# Altium project PIAR_MainBoard.PrjPcb (part 1 of 2)
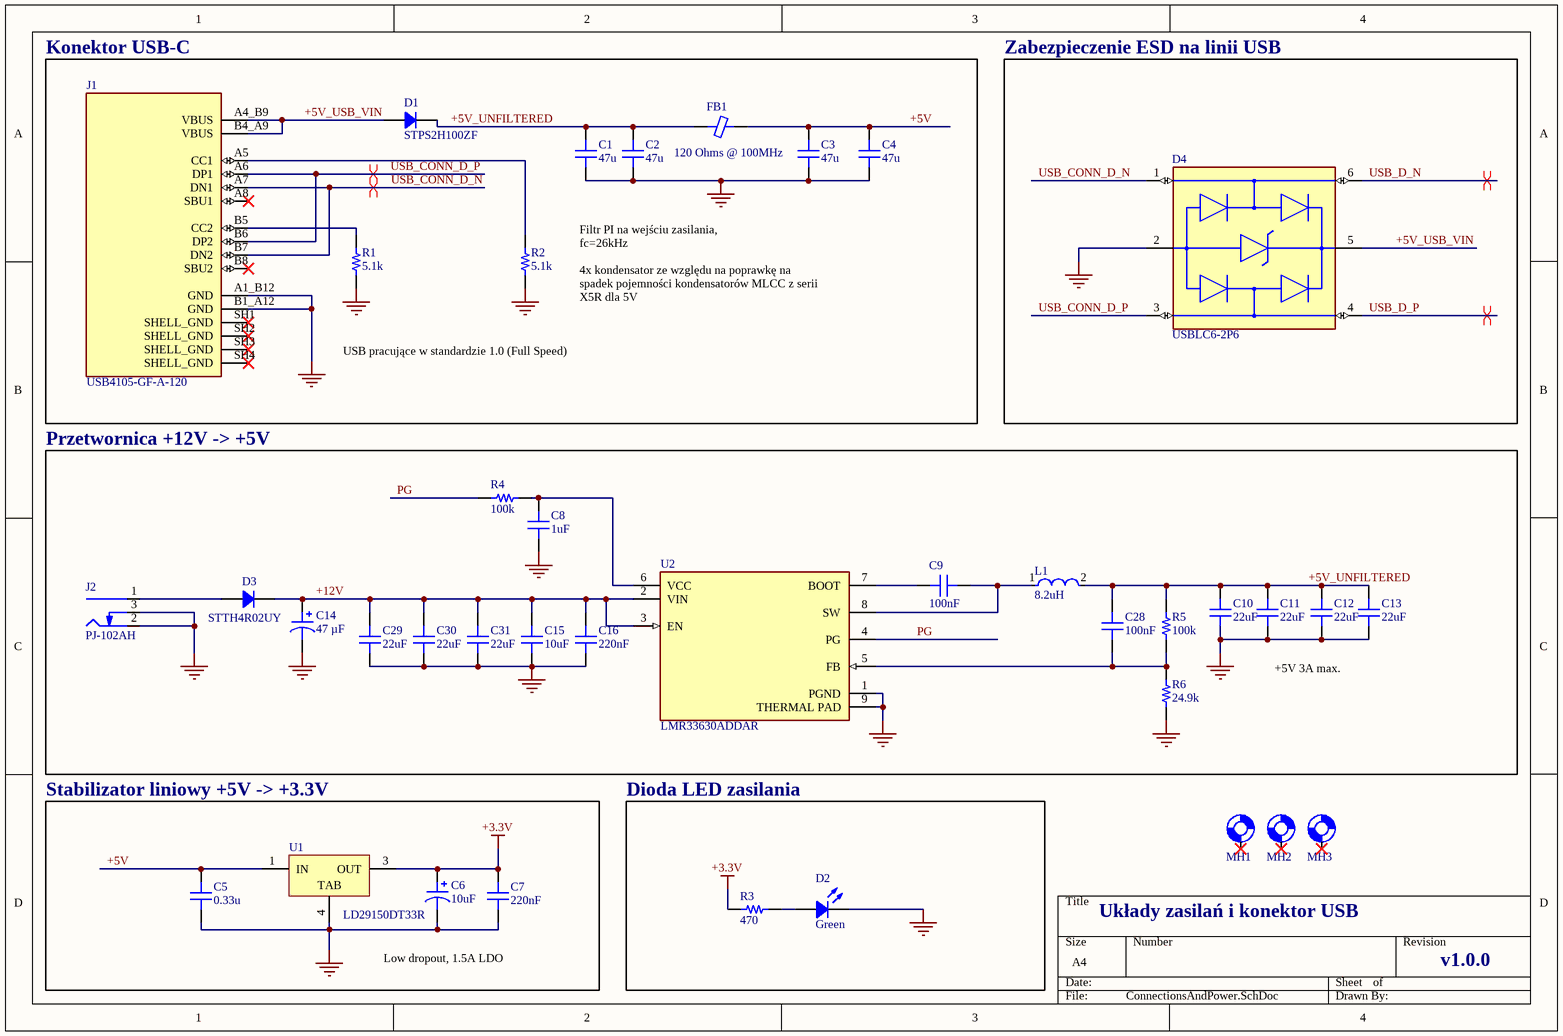
[diagram p0: ConnectionsAndPower.SchDoc]
2 sheets, 79 parts. Net scope: global (net labels, ports and power ports of the same name join across sheets).
Board file: PIAR_MainBoard.PcbDoc
Sheets:
  ConnectionsAndPower.SchDoc
  Motherboard.SchDoc

## Sheet ConnectionsAndPower.SchDoc
size A4; SheetNumber: 1; SheetTotal: 2

### Parts
C1  Capacitance: 47u  [CAP 0805_2012]  (hidden comment: 47 µF)
C2  Capacitance: 47u  [CAP 0805_2012]  (hidden comment: 47 µF)
C3  Capacitance: 47u  [CAP 0805_2012]  (hidden comment: 47 µF)
C4  Capacitance: 47u  [CAP 0805_2012]  (hidden comment: 47 µF)
C5  Capacitance: 0.33u  [CAP 0805_2012]  (hidden comment: 0.33µF)
C6  10uF  [CAP ALSMD POLY 4.3MM H5.5MM]
C7  Capacitance: 220nF  [CAP 0805_2012]  (hidden comment: 0.22 µF)
C8  Capacitance: 1uF  [CAP 0805_2012]  (hidden comment: 1µF)
C9  Capacitance: 100nF  [CAP 0805_2012]  (hidden comment: 0.1 µF)
C10  Capacitance: 22uF  [CAP 0805_2012]  (hidden comment: 22 µF)
C11  Capacitance: 22uF  [CAP 0805_2012]  (hidden comment: 22 µF)
C12  Capacitance: 22uF  [CAP 0805_2012]  (hidden comment: 22 µF)
C13  Capacitance: 22uF  [CAP 0805_2012]  (hidden comment: 22 µF)
C14  47 µF  [CAP ALSMD 4.3MM H5.4MM]
C15  Capacitance: 10uF  [CAP 0805_2012]  (hidden comment: 10 µF)
C16  Capacitance: 220nF  [CAP 0805_2012]  (hidden comment: 0.22 µF)
C28  Capacitance: 100nF  [CAP 0603_1608]  (hidden comment: 0.1 µF)
C29  Capacitance: 22uF  [CAP 0805_2012]  (hidden comment: 22 µF)
C30  Capacitance: 22uF  [CAP 0805_2012]  (hidden comment: 22 µF)
C31  Capacitance: 22uF  [CAP 0805_2012]  (hidden comment: 22 µF)
D1  STPS2H100ZF  [SOD123F]
D2  Green  [LED 0805_2012 GREEN]
D3  STTH4R02UY  [DO214AA SMB]
D4  USBLC6-2P6  [FP-SOT-666-MFG]
FB1  120 Ohms @ 100MHz  [FER 0805_2012]
J1  USB4105-GF-A-120  [USB4105-GF-A-120]
J2  PJ-102AH  [CUI PJ-102AH]
L1  8.2uH  [FP-IHLP-2525CZ-FP_2_413x3-MFG]
MH1  M3 Mounting Hole  [M3_MOUNTING_HOLE]  (value not drawn)
MH2  M3 Mounting Hole  [M3_MOUNTING_HOLE]  (value not drawn)
MH3  M3 Mounting Hole  [M3_MOUNTING_HOLE]  (value not drawn)
R1  5.1k  [RES 0805_2012]
R2  5.1k  [RES 0805_2012]
R3  470  [RES 0805_2012]
R4  100k  [RES 0805_2012]
R5  100k  [RES 0805_2012]
R6  24.9k  [RES 0805_2012]
U1  LD29150DT33R  [TO-252_L]
U2  LMR33630ADDAR  [FP-DDA0008J-IPC_B]

### Blocks framed on the sheet
Konektor USB-C: C1-C4 D1 FB1 J1 R1 R2
Zabezpieczenie ESD na linii USB: D4
Przetwornica +12V -> +5V: C8-C16 C28-C31 D3 J2 L1 R4-R6 U2
Stabilizator liniowy +5V -> +3.3V: C5-C7 U1
Dioda LED zasilania: D2 R3

### Nets
+3.3V: C6.1 C7.2 R3.1 U1.3(OUT)
+5V: C3.2 C4.2 C5.2 FB1.2 U1.1(IN)
+12V: C14.1 C15.2 C16.2 C29.2 C30.2 C31.2 D3.2 U2.2(VIN) U2.3(EN)
GND: C1.1 C2.1 C3.1 C4.1 C5.1 C6.2 C7.1 C8.1 C10.1 C11.1 C12.1 C13.1 C14.2 C15.1 C16.1 C29.1 C30.1 C31.1 D2.2 D4.2(GND) J1.A1_B12(GND) J1.B1_A12(GND) J2.2(Outer) J2.3(SW) R1.1 R2.1 R6.1 U1.4(TAB) U2.1(PGND) U2.9(THERMAL_PAD)
+5V_UNFILTERED: C1.2 C2.2 C10.2 C11.2 C12.2 C13.2 C28.2 D1.2 FB1.1 L1.2 R5.1
+5V_USB_VIN: D1.1 D4.5(VBUS) J1.A4_B9(VBUS) J1.B4_A9(VBUS)
PG: R4.2 U2.4(PG)
USB_CONN_D_N: D4.1(I/O1) J1.A7(DN1) J1.B7(DN2)
USB_CONN_D_P: D4.3(I/O2) J1.A6(DP1) J1.B6(DP2)
USB_D_N: D4.6(I/O1)
USB_D_P: D4.4(I/O2)
NetC8_2: C8.2 R4.1 U2.6(VCC)
NetC9_1: C9.1 L1.1 U2.8(SW)
NetC9_2: C9.2 U2.7(BOOT)
NetC28_1: C28.1 R5.2 R6.2 U2.5(FB)
NetD2_1: D2.1 R3.2
NetD3_1: D3.1 J2.1(Centre)
NetJ1_A5: J1.A5(CC1) R2.2
NetJ1_B5: J1.B5(CC2) R1.2

Not connected (* = marked no-connect by the designer): J1 A8(SBU1)* B8(SBU2)* SH1(SHELL_GND)* SH2(SHELL_GND)* SH3(SHELL_GND)* SH4(SHELL_GND)*; MH1 1*; MH2 1*; MH3 1*

### Layout directives
differential pair: USB_CONN_D_N, USB_CONN_D_P, USB_D_N, USB_D_P

### Notes on the sheet
- Filtr PI na wejściu zasilania,
  fc=26kHz
  4x kondensator ze względu na poprawkę na spadek pojemności kondensatorów MLCC z serii X5R dla 5V
- USB pracujące w standardzie 1.0 (Full Speed)
- +5V 3A max.
- Układy zasilań i konektor USB
- Low dropout, 1.5A LDO
- v1.0.0

### Library data of the parts
C1-C4 = CL21A476MQYNNNE: CAP CER 47UF 6.3V X5R 0805; manufacturer: Samsung Electro-Mechanics; Tolerance: ±20%; Part Number: CL21A476MQYNNNE; Applications: General Purpose; componentlink1description: Datasheet; componentlink1url: http://www.samsungsem.com/kr/support/product-search/mlcc/CL21A476MQYNNNE.jsp; componentlink2description: DigiKey Link; componentlink2url: https://www.digikey.com/en/products/detail/samsung-electro-mechanics/CL21A476MQYNNNE/3887510; Device Package: 0805 (2012 Metric); lastupdated: 09/02/2024 20:16:07; Lifecycle Status: Active; Minimum Order: 1; Mounting Type: Surface Mount, MLCC; Operating Temperature: -55°C ~ 85°C; Package / Case: 0805 (2012 Metric); packaging: TapeAndReel; partid: 3143; Part Status: Active; price: 0.04; series: CL; Size / Dimension: 0.079" L x 0.049" W (2.00mm x 1.25mm); Supplier 1: DigiKey; Supplier Part Number 1: 1276-1852-1-ND; Temperature Coefficient: X5R; Thickness (Max): 0.057" (1.45mm); value: 47 µF; Voltage - Rated: 6.3V
C5 = 08055C334JAT2A: CAP CER 0.33UF 50V X7R 0805; manufacturer: AVX Corporation; Tolerance: ±5%; Part Number: 08055C334JAT2A; Applications: General Purpose; componentlink1description: Datasheet; componentlink1url: http://datasheets.avx.com/X7RDielectric.pdf; componentlink2description: DigiKey Link; componentlink2url: http://digikey.com/product-detail/en/avx-corporation/08055C334JAT2A/478-10554-1-ND/6797428; Device Package: 0805 (2012 Metric); lastupdated: 02/09/2020 01:04:40; Lifecycle Status: Active; Minimum Order: 1; Mounting Type: Surface Mount, MLCC; Operating Temperature: -55°C ~ 125°C; Package / Case: 0805 (2012 Metric); packaging: TapeAndReel; partid: 3295; Part Status: Active; price: 0.14; series: -; Size / Dimension: 0.079" L x 0.049" W (2.00mm x 1.25mm); Supplier 1: DigiKey; Supplier Part Number 1: 478-10554-1-ND; Temperature Coefficient: X7R; Thickness (Max): 0.037" (0.94mm); value: 0.33µF; Voltage - Rated: 50V
C6 = 10SVP10M: CAP ALUM POLY 10UF 20% 10V SMD; manufacturer: Panasonic Electronic Components; Capacitance: 10µF; ESR (Equivalent Series Resistance): 22mOhm; Lifetime @ Temp.: 2000 Hrs @ 105°C; Ripple Current @ High Frequency: 700mA @ 100kHz; Ripple Current @ Low Frequency: 35mA @ 120Hz; Surface Mount Land Size: 0.169" L x 0.169" W (4.30mm x 4.30mm); Type: Polymer; value: 10µF; Part Number: 10SVP10M; Applications: General Purpose; componentlink1description: Datasheet; componentlink1url: http://industrial.panasonic.com/www-cgi/jvcr13pz.cgi?E+CI+4+AAB8008+10SVP10M+8+WW; componentlink2description: DigiKey Link; componentlink2url: http://digikey.com/product-detail/en/panasonic-electronic-components/10SVP10M/P16427CT-ND/4204209; Device Package: Radial, Can - SMD; Height - Seated (Max): 0.217" (5.50mm); lastupdated: 02/09/2020 01:22:02; Lifecycle Status: Active; Minimum Order: 1; Mounting Type: Surface Mount; Operating Temperature: -55°C ~ 105°C; Package / Case: Radial, Can - SMD; packaging: TapeAndReel; partid: 1855; Part Status: Active; price: 0.35; series: OS-CON™, SVP; Size / Dimension: 0.157" Dia (4.00mm); Supplier 1: DigiKey; Supplier Part Number 1: P16427CT-ND; Tolerance: ±20%; Voltage - Rated: 10V
C7 C16 = C0805C224J1REC7800: CAP CER 0805 220NF 100V X7R 5%; manufacturer: KEMET; Part Number: C0805C224J1REC7800; Applications: ESD Protection; componentlink1description: Datasheet; componentlink1url: https://api.kemet.com/component-edge/download/datasheet/C0805C224J1REC7800.pdf; componentlink2description: DigiKey Link; componentlink2url: https://www.digikey.com/en/products/detail/kemet/C0805C224J1REC7800/8643769; Device Package: 0805 (2012 Metric); lastupdated: 09/02/2024 20:15:02; Lifecycle Status: Active; Minimum Order: 1; Mounting Type: Surface Mount, MLCC; Operating Temperature: -55°C ~ 125°C; Package / Case: 0805 (2012 Metric); packaging: TapeAndReel; partid: 31561; Part Status: Active; price: 0.04; series: ESD SMD Comm X7R; Size / Dimension: 0.079" L x 0.049" W (2.00mm x 1.25mm); Supplier 1: DigiKey; Supplier Part Number 1: 399-C0805C224J1REC7800CT-ND; Temperature Coefficient: X7R; Thickness (Max): 0.055" (1.40mm); Tolerance: ±5%; value: 0.22 µF; Voltage - Rated: 100V
C8 = 08055C105K4Z2A: CAP CER 1UF 50V X7R 0805; manufacturer: AVX Corporation; Tolerance: ±10%; Part Number: 08055C105K4Z2A; Applications: Automotive, Boardflex Sensitive; componentlink1description: Datasheet; componentlink1url: http://datasheets.avx.com/FlexitermMLCC.pdf; componentlink2description: DigiKey Link; componentlink2url: http://digikey.com/product-detail/en/avx-corporation/08055C105K4Z2A/478-9557-1-ND/5322895; Device Package: 0805 (2012 Metric); Features: Soft Termination; lastupdated: 02/09/2020 01:04:41; Lifecycle Status: Active; Minimum Order: 1; Mounting Type: Surface Mount, MLCC; Operating Temperature: -55°C ~ 125°C; Package / Case: 0805 (2012 Metric); packaging: TapeAndReel; partid: 2983; Part Status: Active; price: 0.09; Ratings: AEC-Q200; series: FLEXITERM®; Size / Dimension: 0.079" L x 0.049" W (2.00mm x 1.25mm); Supplier 1: DigiKey; Supplier Part Number 1: 478-9557-1-ND; Temperature Coefficient: X7R; Thickness (Max): 0.055" (1.40mm); value: 1µF; Voltage - Rated: 50V
C9 = CC0805MRX7R9BB104: CAP CER 0.1UF 50V X7R 0805; manufacturer: Yageo; Tolerance: ±20%; Part Number: CC0805MRX7R9BB104; Applications: General Purpose; componentlink1description: Datasheet; componentlink1url: https://www.yageo.com/upload/media/product/productsearch/datasheet/mlcc/UPY-GPHC_X7R_6.3V-to-50V_18.pdf; componentlink2description: DigiKey Link; componentlink2url: https://www.digikey.com/en/products/detail/yageo/CC0805MRX7R9BB104/5884281; Device Package: 0805 (2012 Metric); lastupdated: 09/02/2024 20:16:09; Lifecycle Status: Active; Minimum Order: 1; Mounting Type: Surface Mount, MLCC; Operating Temperature: -55°C ~ 125°C; Package / Case: 0805 (2012 Metric); packaging: TapeAndReel; partid: 2475; Part Status: Active; price: 0.01; series: CC; Size / Dimension: 0.079" L x 0.049" W (2.00mm x 1.25mm); Supplier 1: DigiKey; Supplier Part Number 1: 311-4351-1-ND; Temperature Coefficient: X7R; Thickness (Max): 0.037" (0.95mm); value: 0.1 µF; Voltage - Rated: 50V
C10-C13 C29-C31 = CL21A226KOQNNNE: CAP CER 22UF 16V X5R 0805; manufacturer: Samsung Electro-Mechanics; Tolerance: ±10%; Part Number: CL21A226KOQNNNE; Applications: General Purpose; componentlink1description: Datasheet; componentlink1url: http://www.samsungsem.com/kr/support/library/product-catalog/mlcc.jsp; componentlink2description: DigiKey Link; componentlink2url: https://www.digikey.com/en/products/detail/samsung-electro-mechanics/CL21A226KOQNNNE/5961010; Device Package: 0805 (2012 Metric); lastupdated: 09/02/2024 20:16:07; Lifecycle Status: Active; Minimum Order: 1; Mounting Type: Surface Mount, MLCC; Operating Temperature: -55°C ~ 85°C; Package / Case: 0805 (2012 Metric); packaging: TapeAndReel; partid: 3004; Part Status: Active; price: 0.06; series: CL; Size / Dimension: 0.079" L x 0.049" W (2.00mm x 1.25mm); Supplier 1: DigiKey; Supplier Part Number 1: 1276-6526-1-ND; Temperature Coefficient: X5R; Thickness (Max): 0.055" (1.40mm); value: 22 µF; Voltage - Rated: 16V
C14 = EMVA6R3ADA470MD55G: CAP ALUM 47UF 20% 6.3V SMD; manufacturer: United Chemi-Con; Lifetime @ Temp.: 2000 Hrs @ 85°C; Polarization: Polar; Ripple Current @ High Frequency: 35.64 mA @ 100 kHz; Ripple Current @ Low Frequency: 33 mA @ 120 Hz; Surface Mount Land Size: 0.169" L x 0.169" W (4.30mm x 4.30mm); Part Number: EMVA6R3ADA470MD55G; Applications: General Purpose; Capacitance: 47 µF; componentlink1description: Datasheet; componentlink1url: http://www.chemi-con.co.jp/cgi-bin/CAT_DB/SEARCH/cat_db_al.cgi?e=e&j=p&pdfname=mva; componentlink2description: DigiKey Link; componentlink2url: https://www.digikey.com/en/products/detail/united-chemi-con/EMVA6R3ADA470MD55G/756703; Device Package: Radial, Can - SMD; Height - Seated (Max): 0.205" (5.20mm); lastupdated: 03/06/2024 19:53:00; Lifecycle Status: Active; Minimum Order: 1; Mounting Type: Surface Mount; Operating Temperature: -40°C ~ 85°C; Package / Case: Radial, Can - SMD; packaging: TapeAndReel; partid: 7038; Part Status: Active; price: 0.11; series: Alchip™- MVA; Size / Dimension: 0.157" Dia (4.00mm); Supplier 1: DigiKey; Supplier Part Number 1: 565-2056-1-ND; Tolerance: ±20%; value: 47 µF; Voltage - Rated: 6.3 V
C15 = C2012X6S1C106K125AC: CAP CER 10UF 16V X6S 0805; manufacturer: TDK Corporation; Tolerance: ±10%; Part Number: C2012X6S1C106K125AC; Applications: General Purpose; componentlink1description: Datasheet; componentlink1url: https://product.tdk.com/info/en/catalog/datasheets/mlcc_commercial_general_en.pdf?ref_disty=digikey; componentlink2description: DigiKey Link; componentlink2url: https://www.digikey.com/en/products/detail/tdk-corporation/C2012X6S1C106K125AC/2733046; Device Package: 0805 (2012 Metric); Features: Low ESL; lastupdated: 09/02/2024 20:16:08; Lifecycle Status: Active; Minimum Order: 1; Mounting Type: Surface Mount, MLCC; Operating Temperature: -55°C ~ 105°C; Package / Case: 0805 (2012 Metric); packaging: TapeAndReel; partid: 2995; Part Status: Active; price: 0.06; series: C; Size / Dimension: 0.079" L x 0.049" W (2.00mm x 1.25mm); Supplier 1: DigiKey; Supplier Part Number 1: 445-7611-1-ND; Temperature Coefficient: X6S; Thickness (Max): 0.057" (1.45mm); value: 10 µF; Voltage - Rated: 16V
C28 = CL10B104KA8NNNC: CAP CER 0.1UF 25V X7R 0603; manufacturer: Samsung Electro-Mechanics; Tolerance: ±10%; Part Number: CL10B104KA8NNNC; Applications: General Purpose; componentlink1description: Datasheet; componentlink1url: http://www.samsungsem.com/kr/support/product-search/mlcc/CL10B104KA8NNNC.jsp; componentlink2description: DigiKey Link; componentlink2url: https://www.digikey.com/en/products/detail/samsung-electro-mechanics/CL10B104KA8NNNC/3886664; Device Package: 0603 (1608 Metric); lastupdated: 09/02/2024 20:10:20; Lifecycle Status: Active; Minimum Order: 1; Mounting Type: Surface Mount, MLCC; Operating Temperature: -55°C ~ 125°C; Package / Case: 0603 (1608 Metric); packaging: TapeAndReel; partid: 9793; Part Status: Active; price: 0.01; series: CL; Size / Dimension: 0.063" L x 0.031" W (1.60mm x 0.80mm); Supplier 1: DigiKey; Supplier Part Number 1: 1276-1006-1-ND; Temperature Coefficient: X7R; Thickness (Max): 0.035" (0.90mm); value: 0.1 µF; Voltage - Rated: 25V
D1 = STPS2H100ZF: DIODE SCHOTTKY 100V 2A SOD123F; Manufacturer: STMicroelectronics; Current - Reverse Leakage @ Vr: 1 µA @ 100 V; Speed: Fast Recovery =< 500ns, > 200mA (Io); Voltage - Forward (Vf) (Max) @ If: 960 mV @ 4 A; Part Number: STPS2H100ZF; ComponentLink1Description: Datasheet; ComponentLink1URL: http://www.st.com/content/ccc/resource/technical/document/datasheet/group3/e0/1c/dc/bb/11/47/42/2a/DM00321023/files/DM00321023.pdf/jcr:content/translations/en.DM00321023.pdf; ComponentLink2Description: DigiKey Link; ComponentLink2URL: https://www.digikey.com/en/products/detail/stmicroelectronics/STPS2H100ZF/6709839; Current - Average Rectified (Io): 2A; Diode Type: Schottky; LastUpdated: 03/06/2024 19:54:58; Lifecycle Status: Active; Minimum Order: 1; Mounting Type: Surface Mount; Operating Temperature - Junction: -40°C ~ 175°C; Package / Case: SOD-123F; Packaging: TapeAndReel; PartId: 2348; Part Status: Active; Price: 0.06; Series: ECOPACK®2; Supplier 1: DigiKey; Supplier Part Number 1: 497-17152-1-ND; Supplier Device Package: SOD-123F; Voltage - DC Reverse (Vr) (Max): 100 V
D2 = APHCM2012CGCK-F01: LED GREEN CLEAR CHIP SMD; Manufacturer: Kingbright; Configuration: Standard; Current - Test: 20mA; Lens Color: Colorless; Lens Size: 1.30mm x 1.25mm; Lens Style: Rectangle with Flat Top; Millicandela Rating: 50mcd; Viewing Angle: 110°; Voltage - Forward (Vf) (Typ): 2.1V; Wavelength - Dominant: 570nm; Wavelength - Peak: 574nm; Part Number: APHCM2012CGCK-F01; Color: Green; ComponentLink1Description: Datasheet; ComponentLink1URL: http://www.kingbrightusa.com/images/catalog/SPEC/APHCM2012CGCK-F01.pdf; ComponentLink2Description: DigiKey Link; ComponentLink2URL: https://www.digikey.com/en/products/detail/kingbright/APHCM2012CGCK-F01/1747492; Device Package: 0805 (2012 Metric); Height (Max): 0.40mm; LastUpdated: 03/06/2024 20:00:30; Lens Transparency: Clear; Lifecycle Status: Active; Minimum Order: 1; Mounting Type: Surface Mount; Package / Case: 0805 (2012 Metric); Packaging: TapeAndReel; PartId: 241; Part Status: Active; Price: 0.05; Series: -; Size / Dimension: 2.00mm L x 1.25mm W; Supplier 1: DigiKey; Supplier Part Number 1: 754-1094-1-ND; Supplier Device Package: Chip LED; Value: Green
D3 = STTH4R02UY: DIODE GEN PURP 200V 4A SMB; Manufacturer: STMicroelectronics; Current - Reverse Leakage @ Vr: 3 µA @ 200 V; Diode Type: Standard; Reverse Recovery Time (trr): 30 ns; Speed: Fast Recovery =< 500ns, > 200mA (Io); Voltage - Forward (Vf) (Max) @ If: 1.05 V @ 4 A; Part Number: STTH4R02UY; ComponentLink1Description: Datasheet; ComponentLink1URL: http://www.st.com/content/ccc/resource/technical/document/datasheet/f7/b0/f4/2f/8e/1a/4d/1d/CD00270577.pdf/files/CD00270577.pdf/jcr:content/translations/en.CD00270577.pdf; ComponentLink2Description: DigiKey Link; ComponentLink2URL: https://www.digikey.com/en/products/detail/stmicroelectronics/STTH4R02UY/2612178; Current - Average Rectified (Io): 4A; LastUpdated: 03/06/2024 19:53:56; Lifecycle Status: Active; Minimum Order: 1; Mounting Type: Surface Mount; Operating Temperature - Junction: -40°C ~ 175°C; Package / Case: DO-214AA, SMB; Packaging: TapeAndReel; PartId: 297; Part Status: Active; Price: 0.11; Series: Q; Supplier 1: DigiKey; Supplier Part Number 1: 497-11105-1-ND; Supplier Device Package: SMB; Voltage - DC Reverse (Vr) (Max): 200 V
D4 = CMP-12225-000058-1: TVS DIODE 5.25V 17V SOT666; Min Breakdown Voltage: 6V; Power Line Protection: Yes; Element Configuration: Dual; Test Current: 1mA; Working Voltage: 5V; Number of Channels: 2; Max Reverse Leakage Current: 150nA; Direction: Unidirectional; Peak Pulse Current: 5A; Number of Elements: 1; Capacitance: 3.5pF; Max Breakdown Voltage: 6V; Height: 0.6mm; Depth: 1.3mm; Contact Plating: Tin; Reverse Breakdown Voltage: 6V; REACH SVHC: No SVHC; Operating Supply Voltage: 5V; Width: 1.3mm; Max Operating Temperature: 125°C; Reverse Standoff Voltage: 5V; ESD Protection: Yes; Package Quantity: 1; Termination: SMD/SMT; Length: 1.7mm; Leakage Current: 150nA; Number of Bidirectional Channels: 2; Case/Package: SOT-666; Min Operating Temperature: -40°C; Number of Pins: 6; Clamping Voltage: 17V; Breakdown Voltage: 6V; Lead Free: Lead Free; Radiation Hardening: No; Packaging: Tape and Reel; Mount: Surface Mount; Polarity: Unidirectional
FB1 = BBUP00201209121Y00: EMI BEAD FILETER; Manufacturer: Chilisin Electronics; Current Rating (Max): 5A; DC Resistance (DCR) (Max): 20mOhm; Number of Lines: 1; Part Number: BBUP00201209121Y00; ComponentLink1Description: Datasheet; ComponentLink1URL: https://www.chilisin.com/upload/media/product/emi_bead/file/BBUP_Series.pdf; ComponentLink2Description: DigiKey Link; ComponentLink2URL: http://digikey.com/product-detail/en/chilisin-electronics/BBUP00201209121Y00/2184-BBUP00201209121Y00CT-ND/10509429; Device Package: 0805 (2012 Metric); Impedance @ Frequency: 120 Ohms @ 100MHz; LastUpdated: 03/06/2024 19:52:19; Lifecycle Status: Active; Minimum Order: 1; Mounting Type: Surface Mount; Operating Temperature: -55°C ~ 125°C; Package / Case: 0805 (2012 Metric); Packaging: Unknown; PartId: 1880; Part Status: Active; Price: 0.04; Series: *; Supplier 1: DigiKey; Supplier Part Number 1: 2184-BBUP00201209121Y00CT-ND; Value: 120 Ohms @ 100MHz
J1 = USB4105-GF-A-120: USB C socket; SMT; PIN: 16; top board mount; 5A
J2 = PJ-102AH: CONN PWR JACK 2X5.5MM SOLDER; Manufacturer: CUI Devices; Actual Diameter: 0.079" (2.00mm ID), 0.256" (6.50mm OD); Current Rating (Amps): 5A; Gender: Male; Industry Recognized Mating Diameter: 2.00mm ID (0.079"), 5.50mm OD (0.217"); Internal Switch(s): Single Switch, Normally Closed; Material Flammability Rating: UL94 V-0; Mating Length/Depth: 0.354" (9.00mm); Number of Positions/Contacts: 2 Conductors, 3 Contacts; Shielding: Unshielded; Voltage - Rated: 24VDC; Part Number: PJ-102AH; ComponentLink1Description: Datasheet; ComponentLink1URL: https://www.cuidevices.com/product/resource/digikeypdf/pj-102ah.pdf; ComponentLink2Description: DigiKey Link; ComponentLink2URL: //digikey.com/product-detail/en/cui-devices/PJ-102AH/CP-102AH-ND/408448; Connector Type: Jack; LastUpdated: 16/12/2019 19:01:27; Lifecycle Status: 0; Minimum Order: 1; Mounting Type: Through Hole, Right Angle; Packaging: Tray; Part Status: Active; Price: 0.76; Series: -; Supplier 1: DigiKey; Supplier Part Number 1: CP-102AH-ND; Termination: Solder
L1 = CMP-02424-000673-1: Commercial Inductors, High Saturation Series 8.2uH 4A 68mΩ 20%; Shielding: Shielded; Test Frequency: 100kHz; Saturation Current: 7.5A; Core Material: Metal; Self Resonant Frequency: 5MHz; DC Resistance (DCR): 68mR; Depth: 6.72mm; Lead Free: Lead Free; Max Operating Temperature: 125°C; Width: 6.47mm; Height - Seated (Max): 0.118inch; Min Operating Temperature: -55°C; Package Quantity: 2000; Case/Package: 2525; Military Standard: Not; Inductance: 8.2uH; Tolerance: 20%; Number of Pins: 2; Inductance Tolerance: 20%; Contact Plating: Tin; Current Rating: 4A; Max DC Current: 7.5A; Mount: Surface Mount; Length: 7.24mm; Termination: SMD/SMT; Radiation Hardening: No; RMS Current (Irms): 4A; Packaging: Tape and Reel; Height: 3mm
R1 R2 = ERA-6AED512V: RES SMD 5.1K OHM 0.5% 1/8W 0805; Manufacturer: Panasonic Electronic Components; Power (Watts): 0.125W, 1/8W; Resistance: 5.1 kOhms; Temperature Coefficient: ±25ppm/°C; Part Number: ERA-6AED512V; Value: 5.1k; ComponentLink1Description: Datasheet; ComponentLink1URL: https://industrial.panasonic.com/cdbs/www-data/pdf/RDM0000/AOA0000C307.pdf; ComponentLink2Description: DigiKey Link; ComponentLink2URL: https://www.digikey.com/en/products/detail/panasonic-electronic-components/ERA-6AED512V/9373625; Composition: Thin Film; Device Package: 0805 (2012 Metric); Features: Automotive AEC-Q200; Height - Seated (Max): 0.024" (0.60mm); LastUpdated: 08/02/2024 21:02:38; Lifecycle Status: Active; Minimum Order: 1; Number of Terminations: 2; Operating Temperature: -55°C ~ 155°C; Package / Case: 0805 (2012 Metric); Packaging: TapeAndReel; PartId: 27812; Part Status: Active; Price: 0.04; Ratings: AEC-Q200; Series: ERA-6A; Size / Dimension: 0.079" L x 0.049" W (2.00mm x 1.25mm); Supplier 1: DigiKey; Supplier Part Number 1: P123856CT-ND; Supplier Device Package: 0805; Tolerance: ±0.5%
R3 = CRGP0805F470R: RES 470 OHM 1% 1/3W 0805; Manufacturer: TE Connectivity Passive Product; Power (Watts): 0.333W, 1/3W; Resistance: 470 Ohms; Temperature Coefficient: ±100ppm/°C; Part Number: CRGP0805F470R; Value: 470; ComponentLink1Description: Datasheet; ComponentLink1URL: https://www.te.com/commerce/DocumentDelivery/DDEController?Action=srchrtrv&DocNm=9-1773463-9&DocType=DS&DocLang=English; ComponentLink2Description: DigiKey Link; ComponentLink2URL: https://www.digikey.com/en/products/detail/te-connectivity-passive-product/CRGP0805F470R/8577075; Composition: Thick Film; Device Package: 0805 (2012 Metric); Features: Pulse Withstanding; Height - Seated (Max): 0.026" (0.65mm); LastUpdated: 08/02/2024 21:02:34; Lifecycle Status: Active; Minimum Order: 1; Number of Terminations: 2; Operating Temperature: -55°C ~ 155°C; Package / Case: 0805 (2012 Metric); Packaging: TapeAndReel; PartId: 28801; Part Status: Active; Price: 0.02; Series: CRGP; Size / Dimension: 0.079" L x 0.049" W (2.00mm x 1.25mm); Supplier 1: DigiKey; Supplier Part Number 1: A130473CT-ND; Supplier Device Package: 0805; Tolerance: ±1%
R4 R5 = CPF0805B100KE: RES SMD 100K OHM 0.1% 1/10W 0805; Manufacturer: TE Connectivity Passive Product; Power (Watts): 0.1W, 1/10W; Resistance: 100 kOhms; Temperature Coefficient: ±25ppm/°C; Part Number: CPF0805B100KE; Value: 100k; ComponentLink1Description: Datasheet; ComponentLink1URL: https://www.te.com/commerce/DocumentDelivery/DDEController?Action=srchrtrv&DocNm=1773200&DocType=DS&DocLang=English; ComponentLink2Description: DigiKey Link; ComponentLink2URL: https://www.digikey.com/en/products/detail/te-connectivity-passive-product/CPF0805B100KE/2389788; Composition: Thin Film; Device Package: 0805 (2012 Metric); Height - Seated (Max): 0.026" (0.65mm); LastUpdated: 08/02/2024 21:02:39; Lifecycle Status: Active; Minimum Order: 1; Number of Terminations: 2; Operating Temperature: -55°C ~ 155°C; Package / Case: 0805 (2012 Metric); Packaging: TapeAndReel; PartId: 27729; Part Status: Active; Price: 0.09; Series: CPF, Neohm; Size / Dimension: 0.079" L x 0.049" W (2.00mm x 1.25mm); Supplier 1: DigiKey; Supplier Part Number 1: A106042CT-ND; Supplier Device Package: 0805; Tolerance: ±0.1%
R6 = RNCF0805DTE24K9: RES SMD 24.9K OHM 0.5% 1/4W 0805; Manufacturer: Stackpole Electronics Inc; Power (Watts): 0.25W, 1/4W; Resistance: 24.9 kOhms; Temperature Coefficient: ±25ppm/°C; Part Number: RNCF0805DTE24K9; Value: 24.9k; ComponentLink1Description: Datasheet; ComponentLink1URL: https://www.seielect.com/catalog/sei-rncf.pdf; ComponentLink2Description: DigiKey Link; ComponentLink2URL: https://www.digikey.com/en/products/detail/stackpole-electronics-inc/RNCF0805DTE24K9/6241929; Composition: Thin Film; Device Package: 0805 (2012 Metric); Features: Automotive AEC-Q200; Height - Seated (Max): 0.026" (0.65mm); LastUpdated: 08/02/2024 21:02:37; Lifecycle Status: Active; Minimum Order: 1; Number of Terminations: 2; Operating Temperature: -55°C ~ 155°C; Package / Case: 0805 (2012 Metric); Packaging: TapeAndReel; PartId: 28005; Part Status: Active; Price: 0.01; Ratings: AEC-Q200; Series: RNCF; Size / Dimension: 0.079" L x 0.049" W (2.00mm x 1.25mm); Supplier 1: DigiKey; Supplier Part Number 1: 738-RNCF0805DTE24K9CT-ND; Supplier Device Package: 0805; Tolerance: ±0.5%
U1 = CMP-0244-00130-1: 1.5A, Very-Low Drop Voltage Regulator, 3.3V, 3-Pin DPAK; PackageReference: TO-252; PackageDescription: 3-Pin Transistor Outline Package 2.28 mm Pitch, 9.7 mm Lead Span (DPAK); ComponentLink2Description: Datasheet; ComponentLink1URL: http://www.st.com; DatasheetVersion: 27/10/2010; ComponentLink1Description: Manufacturer URL; ComponentLink2URL: http://www.st.com/internet/com/TECHNICAL_RESOURCES/TECHNICAL_LITERATURE/DATASHEET/CD00003403.pdf; PackageVersion: 2011
U2 = CMP-04918-000184-1: IC REG BUCK ADJUSTABLE 3A 8SOPWR; Switching Frequency: 400kHz; Number of Outputs: 1; Output Configuration: Positive; Synchronous Rectifier: Yes; Min Output Voltage: 1V; Max Output Voltage: 24V; Max Input Voltage: 36V; Min Input Voltage: 3.8V; Output Current: 3A; Min Operating Temperature: -40°C; Max Operating Temperature: 125°C; Number of Pins: 8; RoHS Compliant: Yes; Mount: Surface Mount; Output Type: Adjustable; Packaging: Cut Tape